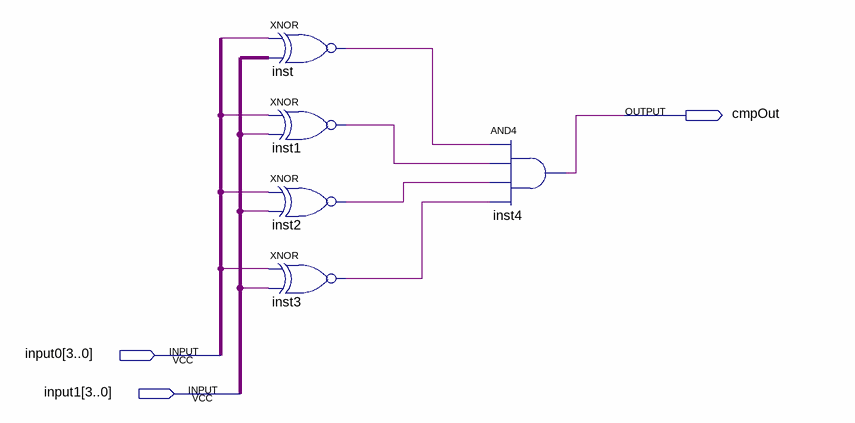
[diagram p0: schematic sheet]
// Quartus schematic EpCmp4.bdf as structural Verilog: 5 symbols, 3 pins
module EpCmp4 (
  input  [3:0] input0,
  input  [3:0] input1,
  output cmpOut
);

  wire inst1_out, inst2_out, inst3_out, inst_out, undriven, undriven_2, undriven_3, undriven_4, undriven_5,
       undriven_6, undriven_7;

  assign inst_out = ~({4{undriven_7}} ^ input1);  // XNOR inst, 4 bits wide
  xnor inst1 (inst1_out, undriven_6, undriven);
  xnor inst2 (inst2_out, undriven_5, undriven_2);
  xnor inst3 (inst3_out, undriven_4, undriven_3);
  and inst4 (cmpOut, inst_out, inst1_out, inst2_out, inst3_out);
endmodule
